# EasyEDA schematic SENSOR_SCH.json
TITLE: DRONE_SENSOR_SHIELD; REV: 1.0; Date: 2023-10-10; Sheet: 1/1; Drawn By: J.Rainey; Company: QUB
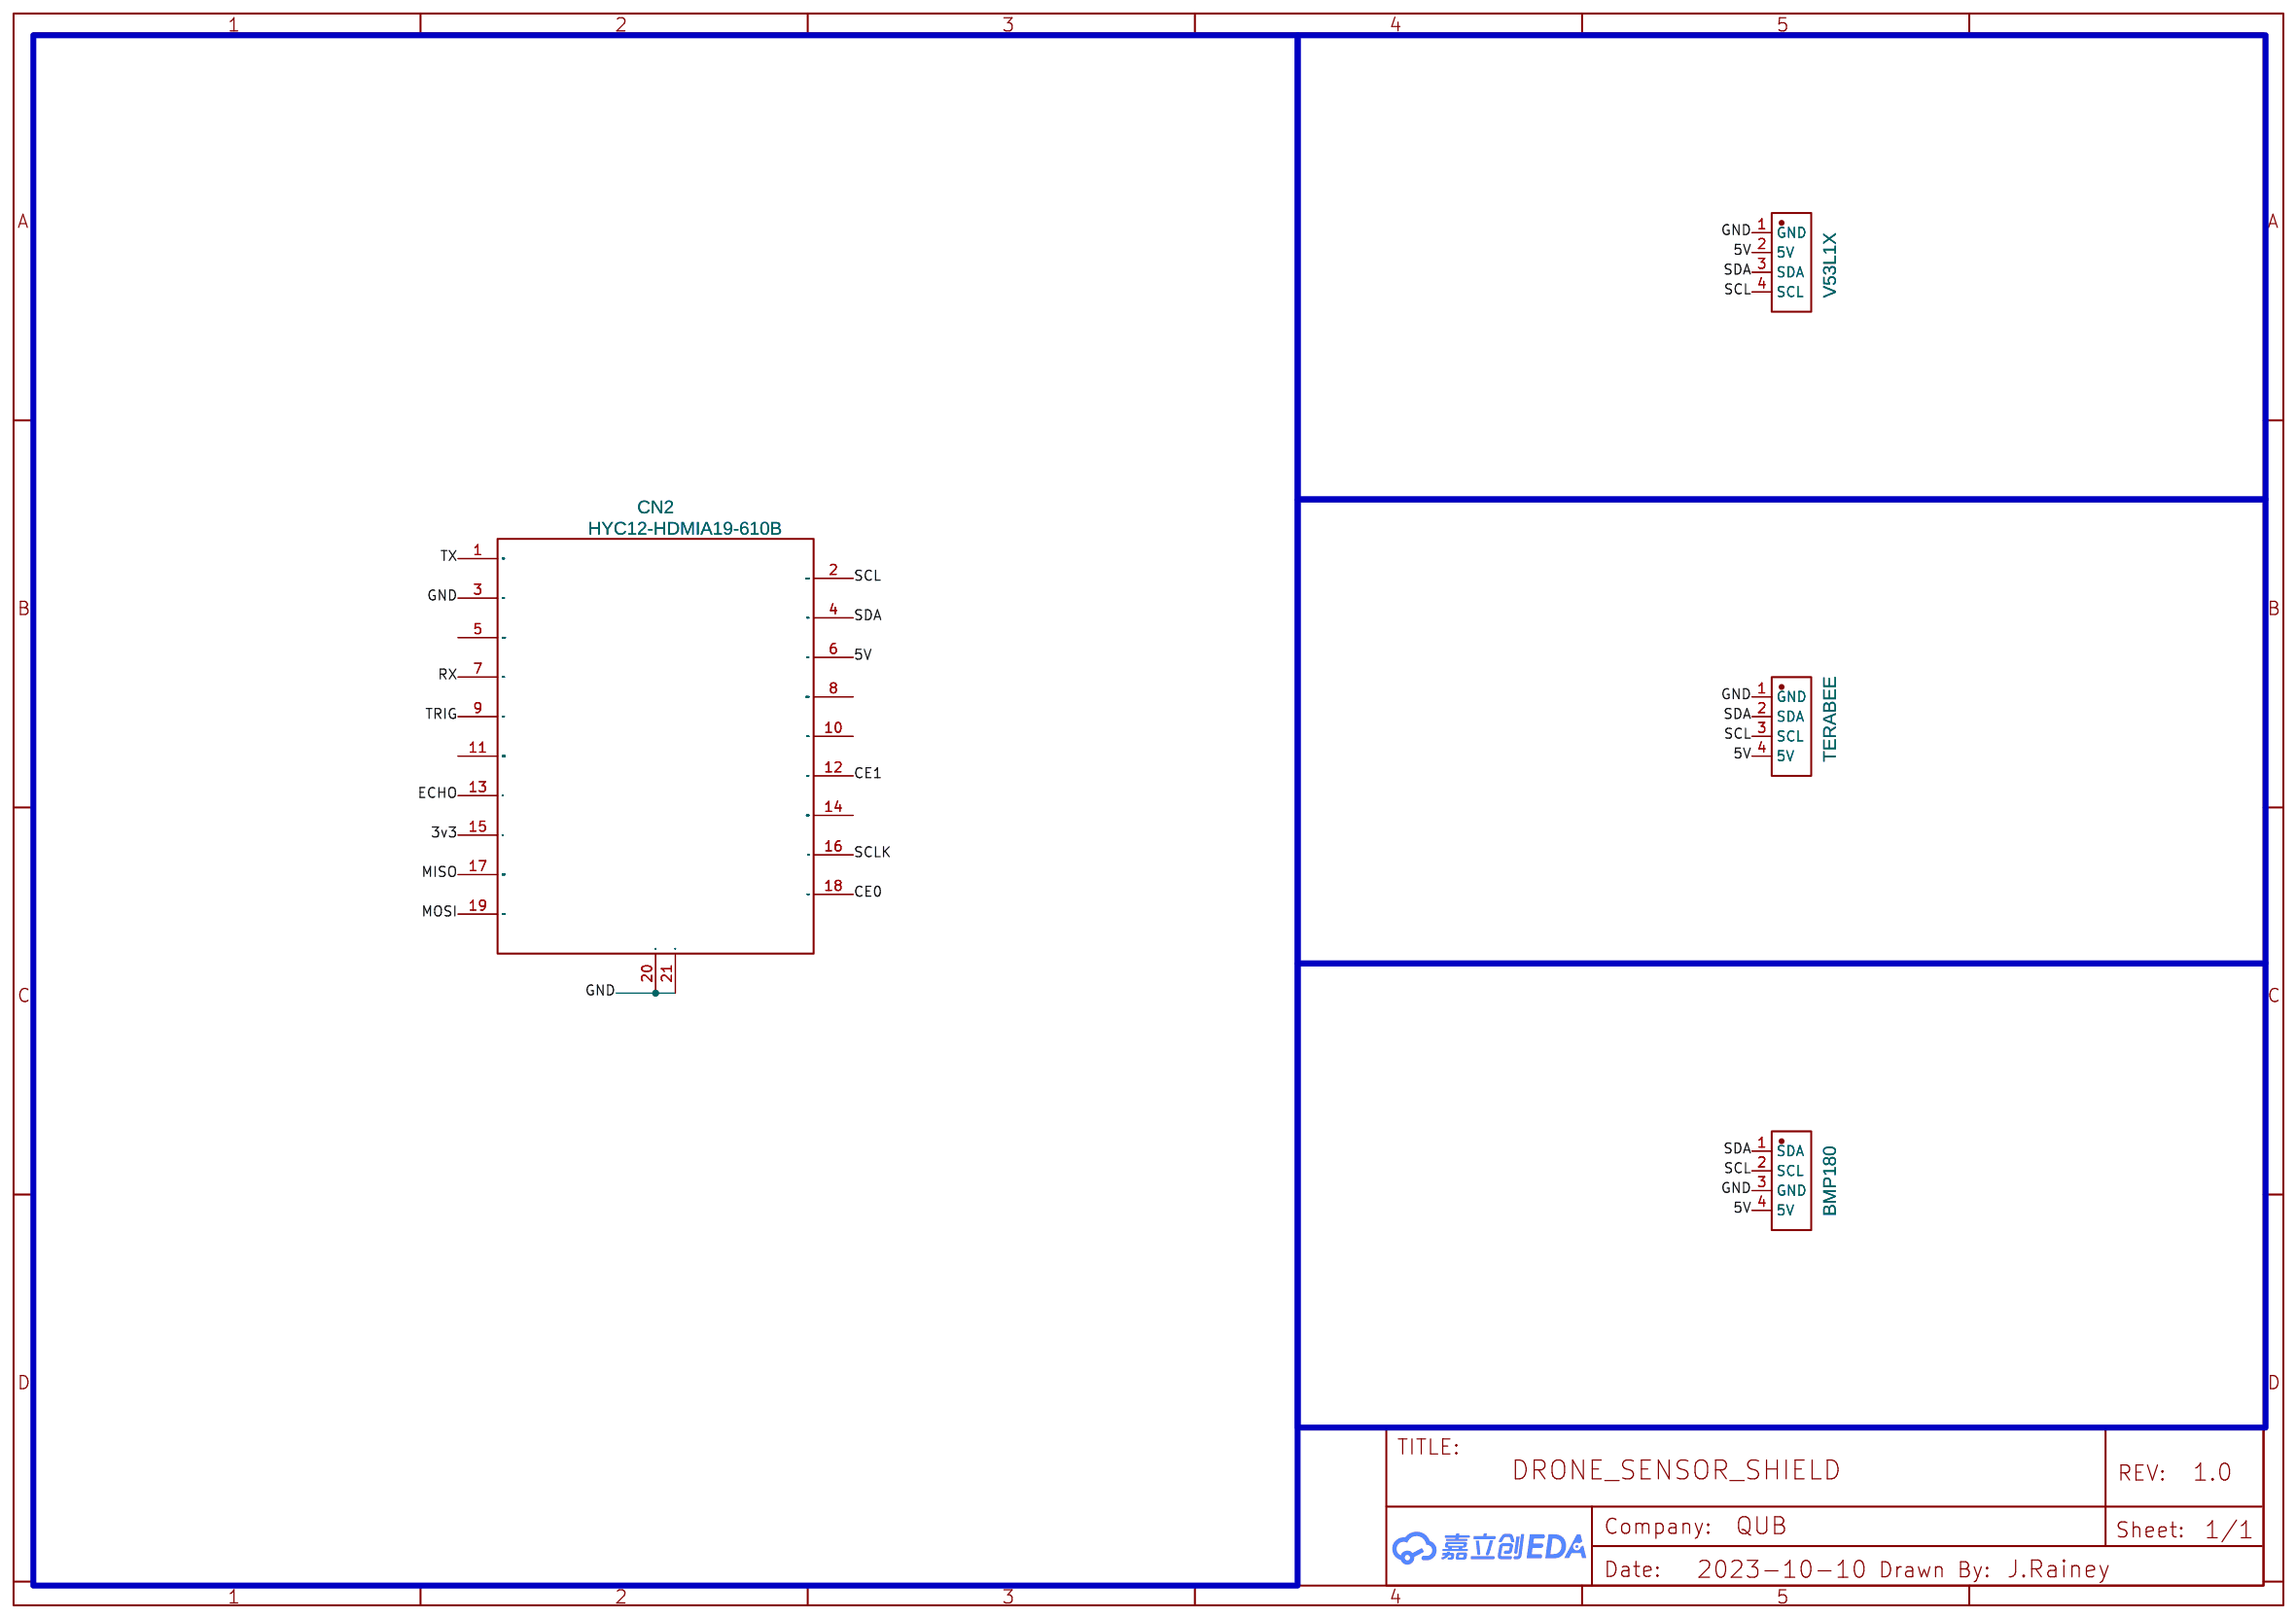
[diagram p0: schematic sheet]

## Parts
BMP180  PZ254V-11-04P  [HDR-TH_4P-P2.54-V-M]
CN2  HYC12-HDMIA19-610B  [HDMI-TH_HYC12-HDMIA19-61]
TERABEE  PZ254V-11-04P  [HDR-TH_4P-P2.54-V-M]
V53L1X  PZ254V-11-04P  [HDR-TH_4P-P2.54-V-M]

## Library data of the parts
BMP180 TERABEE V53L1X = PZ254V-11-04P: Supplier: LCSC; Supplier Part: C492403; Manufacturer: XFCN; Contributor: vatsal patel; JLCPCB Part Class: Extended Part
CN2 = HYC12-HDMIA19-610B: Supplier: LCSC; Supplier Part: C711354; Manufacturer: 华宇创; Contributor: LCSC; JLCPCB Part Class: Extended Part

## Nets
3v3: CN2.15(SCL)
5V: BMP180.4(5V) CN2.6(TMDS Data 1-) TERABEE.4(5V) V53L1X.2(5V)
GND: BMP180.3(GND) CN2.3(TMDS Data 2-) CN2.20(EH) CN2.21(EH) TERABEE.1(GND) V53L1X.1(GND)
CE0: CN2.18(+5V Power)
CE1: CN2.12(TMDS Clock-)
ECHO: CN2.13(CEC)
MISO: CN2.17(DDC/CEC Ground)
MOSI: CN2.19(Hot Plug Detect)
RX: CN2.7(TMDS Data 0+)
SCL: BMP180.2(SCL) CN2.2(TMDS Data 2 Shield) TERABEE.3(SCL) V53L1X.4(SCL)
SCLK: CN2.16(SDA)
SDA: BMP180.1(SDA) CN2.4(TMDS Data 1+) TERABEE.2(SDA) V53L1X.3(SDA)
TRIG: CN2.9(TMDS Data 0-)
TX: CN2.1(TMDS Data 2+)

Not connected (* = marked no-connect by the designer): CN2 5(TMDS Data 1 Shield) 8(TMDS Data 0 Shield) 10(TMDS Clock+) 11(TMDS Clock Shield) 14(Reserved (N.C.))
